# Altium project Smart_home_system.PrjPcb
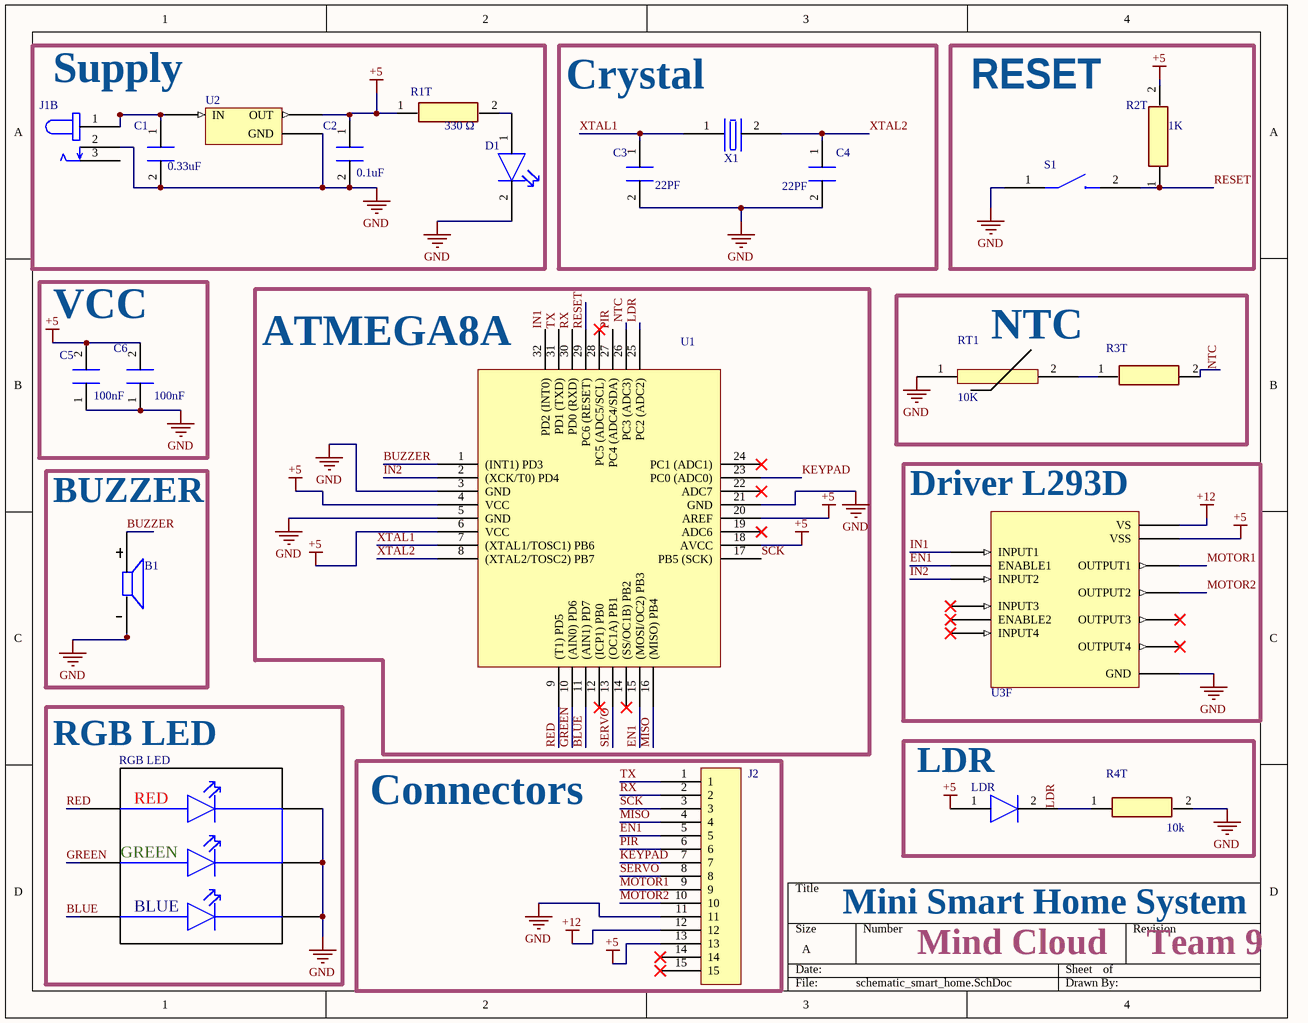
[diagram p0: schematic_smart_home.SchDoc]
Date: 9/2024; designer: Team 9; project: smart home system; Team: mind cloud
1 sheet, 22 parts. Net scope: global (net labels, ports and power ports of the same name join across sheets).
Board file: PCB_smart_home.PcbDoc

## Sheet schematic_smart_home.SchDoc
size A; SheetNumber: 1; SheetTotal: 1

### Parts
B1  CMT-1271-88-SMT-TR  [PCBComponent_1]  (value not drawn)
C1  0.33uF  [PCBComponent_1]
C2  0.1uF  [PCBComponent_1]
C3  22PF  [PCBComponent_1]
C4  22PF  [PCBComponent_1]
C5  100nF  [PCBComponent_1]
C6  100nF  [PCBComponent_1]
D1  KPT-1608ZGC  [PCBComponent_1]  (value not drawn)
J1  PJ-002AH-SMT-TR  [PCBComponent_1]  (value not drawn)  (part B of 2)
J2  connector;str header;single row;.1 cont centers;.095 tail;gold or gtx;36 contact  [Header]  (value not drawn)
LDR  RS1G  [PCBComponent_1]  (value not drawn)
R1  330 Ω  [RESC1005X04N]  (part T of 20)
R2  1K  [RESC1005X04N]  (part T of 20)
R3  resistor SMD  [RESC1005X04N]  (value not drawn)  (part T of 20)
R4  10k  [RESC1005X04N]  (part T of 20)
RGB_LED  ASMB-TTF2-0B20B  [PCBComponent_1]  (value not drawn)
RT1  10K  [RESC1005X04N]
S1  TS16-1212-85-BK-100-SMT-TR  [PCBComponent_1]  (value not drawn)
U1  ATMEGA8A-AU_C16190  [TQFP80P900X900X120-32N]  (value not drawn)
U2  MC78M05ACDTRKG  [PCBComponent_1]  (value not drawn)
U3  Driver L293D  [SOIC127P1030X265-20N]  (value not drawn)  (part F of 6)
X1  16 MHZ  [PCBComponent_1]  (value not drawn)

### Blocks framed on the sheet
Supply: C1 C2 D1 J1 R1 U2
Crystal: C3 C4 X1
RESET: R2 S1
VCC: C5 C6
ATMEGA8A: U1
NTC: R3 RT1
BUZZER: B1
Driver L293D: U3
RGB LED: RGB_LED
Connectors: J2
LDR: LDR R4

### Nets
+5: C2.1 C5.2 C6.2 J2.13 LDR.1 R1.1 R2.2 U1.4(VCC) U1.6(VCC) U1.18(AVCC) U1.20(AREF) U2.2(OUT) U3.7(VSS)
+12: J2.12 U3.6(INPUT4)
GND: B1.2 C1.2 C2.2 C3.2 C4.2 C5.1 C6.1 D1.2 J1.2 J2.11 R4.2 RGB_LED.2 RGB_LED.4 RGB_LED.6 RT1.1 S1.1 U1.3(GND) U1.5(GND) U1.21(GND) U2.3(GND) U3.13(GND)
BLUE: RGB_LED.5 U1.11((AIN1)_PD7)
BUZZER: B1.1 U1.1((INT1)_PD3)
EN1: J2.5 U1.15((MOSI/OC2)_PB3) U3.2(ENABLE1)
GREEN: RGB_LED.3 U1.10((AIN0)_PD6)
IN1: U1.32(PD2_(INT0)) U3.1(INPUT1)
IN2: U1.2((XCK/T0)_PD4) U3.3(INPUT2)
KEYPAD: J2.7 U1.23(PC0_(ADC0))
LDR: LDR.2 R4.1 U1.25(PC2_(ADC2))
MISO: J2.4 U1.16((MISO)_PB4)
MOTOR1: J2.9 U3.9(OUTPUT1)
MOTOR2: J2.10 U3.10(OUTPUT2)
NTC: R3.2 U1.26(PC3_(ADC3))
PIR: J2.6 U1.27(PC4_(ADC4/SDA))
RED: RGB_LED.1 U1.9((T1)_PD5)
RESET: R2.1 S1.2 U1.29(PC6_(RESET))
RX: J2.2 U1.30(PD0_(RXD))
SCK: J2.3 U1.17(PB5_(SCK))
SERVO: J2.8 U1.13((OC1A)_PB1)
TX: J2.1 U1.31(PD1_(TXD))
XTAL1: C3.1 U1.7((XTAL1/TOSC1)_PB6) X1.1
XTAL2: C4.1 U1.8((XTAL2/TOSC2)_PB7) X1.2
NetC1_1: C1.1 J1.1 U2.1(IN)
NetD1_1: D1.1 R1.2
NetR3_1: R3.1 RT1.2

Not connected (* = marked no-connect by the designer): J1 3; J2 14* 15*; U1 12((ICP1)_PB0)* 14((SS/OC1B)_PB2)* 19(ADC6)* 22(ADC7)* 24(PC1_(ADC1))* 28(PC5_(ADC5/SCL))*; U3 4(INPUT3)* 5(ENABLE2)* 11(OUTPUT3)* 12(OUTPUT4)*

### Notes on the sheet
- Mini Smart Home System
- Mind Cloud
- Team 9
- (in symbol RGB LED) RED; GREEN; BLUE

### Library data of the parts
B1 = buzzer: 88dB Passive (external drive) Electromagnetic Type 2.4kHz Buzzers ROHS; manufactor: CUI; ComponentLink1Description: snapeda link; ComponentLink1URL: https://www.snapeda.com/parts/CMT-1271-88-SMT-TR/CUI%20Devices/view-part/?ref=search&t=Buzzer%20smd; ComponentLink2Description: datasheet; ComponentLink2URL: https://www.snapeda.com/parts/CMT-1271-88-SMT-TR/CUI%20Devices/datasheet/; manufactor part number: CMT-1271-88-SMT-TR; supplier: LCSC; supplier part number: C3811771
C1-C6 = capacitor_1206 CODE: 100V 100nF C0G ±5% 1206 Multilayer Ceramic Capacitors MLCC - SMD/SMT ROHS; manufactor: Murata Electronics; manufactor part number: GRM31C5C2A104JA01L; ComponentLink1Description: snapeda link; ComponentLink1URL: https://www.snapeda.com/parts/GRM31C5C2A104JA01L/Murata/view-part/?ref=search&t=1206%20cap%20smd; ComponentLink2Description: Datasheet; ComponentLink2URL: https://www.snapeda.com/parts/GRM31C5C2A104JA01L/Murata/datasheet/; supplier: LCSC; supplier part number: C405303
D1 = LED: SMD LED Indication - Discrete ROHS; manufacturer: Kingbright; ComponentLink1Description: datasheet; ComponentLink1URL: https://www.snapeda.com/parts/KPT-1608ZGC/Kingbright/datasheet/; ComponentLink2Description: snapeda link; ComponentLink2URL: https://www.snapeda.com/parts/KPT-1608ZGC/Kingbright/view-part/?welcome=home&ref=search&t=LED+SMD; ComponentLink3Description: LCSC link; ComponentLink3URL: https://www.lcsc.com/product-detail/LED-Indication-Discrete_Kingbright-KPT-1608ZGC_C598364.html; manufacturer part number: KPT-1608ZGC; supplier: LCSC; supplier part number: C598364
J1 = DC connector: SMD DC Power Connectors ROHS; Manufacturer: CUI; ComponentLink1Description: snapeda link; ComponentLink1URL: https://www.snapeda.com/parts/PJ-002AH-SMT-TR/CUI%20Devices/view-part/?ref=search&t=DC%20connector%20SMD; ComponentLink2Description: datasheet; ComponentLink2URL: https://www.snapeda.com/parts/PJ-002AH-SMT-TR/CUI%20Devices/datasheet/; Manufacturer part number: PJ-002AH-SMT-TR; supplier: LCSC; supplier part number: C22434687; package: SMD
J2 = Single row; PCB headers: Manufacturer: FCI; Manufacturer Part No.: 68000-236HLF; Current Rating: 3Amps Continuous; Created By: R Kanjee; Date Created: 1 March 2015; RS Stock No.: 2509565626
LDR = LDR sensor: 1A Independent Type 1.3V@1A 400V SMA(DO-214AC) Diodes - General Purpose ROHS; manufactor: SMC(Sangdest Microelectronicstronic (Nanjing)); ComponentLink1Description: snapeda; ComponentLink1URL: https://www.snapeda.com/parts/RS1G/Taiwan%20Semiconductor/view-part/?ref=search&t=LDR%20sensor%20smd; ComponentLink2Description: datasheet; ComponentLink2URL: https://www.snapeda.com/parts/RS1G/Taiwan%20Semiconductor/datasheet/; manufactor part time: RS1G; supplier: LCSC; supplier part time: C260336
R1-R4 = Resistor: 500mW Thick Film Resistors 400V ±100ppm/℃ ±1% 100Ω 1210 Chip Resistor - Surface Mount ROHS; Manufacturer: PANASONIC; Manufacturer part Number: ERJ-U14F1000U; ComponentLink1Description: Datasheet; ComponentLink1URL: https://www.lcsc.com/datasheet/lcsc_datasheet_2201131530_PANASONIC-ERJ-U14F1000U_C1014086.pdf; Supplier: Lcsc; Supplier part number: C1014086
RGB_LED = RGB LED: PLCC-6 RGB LEDs ROHS; manufactor: Broadcom Limited; ComponentLink1Description: snapeda link; ComponentLink1URL: https://www.snapeda.com/parts/ASMB-TTF2-0B20B/Broadcom%20%2F%20Avago/view-part/?ref=search&t=RGB%20led%20smd; ComponentLink2Description: datasheet; ComponentLink2URL: https://www.snapeda.com/parts/ASMB-TTF2-0B20B/Avago%20Technologies/datasheet/; ComponentLink3Description: LCSC link; ComponentLink3URL: https://www.lcsc.com/product-detail/RGB-LEDs_Broadcom-Limited-ASMB-TTF2-0B20B_C6126294.html; manufactor part number: ASMB-TTF2-0B20B; supplier: LCSC; supplier part number: C6126294
RT1 = NTC temperature sensor: 10kΩ ±0.5% 3380K ±0.7% 0402 NTC Thermistors ROHS / Recommended For You; Manufacturer: Murata Electronics; Manufacturer part number: NCU15XH103D6SRC; ComponentLink1Description: datasheet; ComponentLink1URL: https://www.lcsc.com/datasheet/lcsc_datasheet_2401291008_Murata-Electronics-NCU15XH103D6SRC_C17294780.pdf; supplier: lcsc; supplier part number: C17294780
S1 = switch: 50mA Standing paste SPST - normally open 100gf 12V Tactile Switches ROHS; manufactor: CUI; ComponentLink1Description: snapeda; ComponentLink1URL: https://www.snapeda.com/parts/TS16-1212-85-BK-100-SMT-TR/CUI%20Devices/view-part/?ref=search&t=switch%20smd; ComponentLink2Description: datasheet; ComponentLink2URL: https://www.snapeda.com/parts/TS16-1212-85-BK-100-SMT-TR/CUI%20Devices/datasheet/; manufactor part time: TS16-1212-85-BK-100-SMT-TR; supplier: LCSC; supplier part number: C6338790
U1 = ATMEGA8A-AU: 8KB 1KB FLASH 23 2.7V~5.5V AVR 16MHz TQFP-32(7x7) Microcontrollers (MCU/MPU/SOC) ROHS; Manufacturer: Microchip Tech; ComponentLink1Description: Datasheet; ComponentLink1URL: https://www.lcsc.com/datasheet/lcsc_datasheet_1810161120_Microchip-Tech-ATMEGA8A-AU_C16190.pdf; Manufacturer part number: ATMEGA8A-AU; supplier: LCSC; Supplier part number: C16190
U2 = regulator: 500mA 80dB@(120Hz) Fixed 5V Positive electrode 35V TO-252-2(DPAK) Voltage Regulators - Linear, Low Drop Out (LDO) Regulators ROHS; Manufacturer: onsemi; ComponentLink1Description: snapeda link; ComponentLink1URL: https://www.snapeda.com/parts/MC78M05ACDTRKG/onsemi/view-part/?ref=search&t=regulator%205v%20smd; ComponentLink2Description: Datasheet; ComponentLink2URL: https://www.snapeda.com/parts/MC78M05ACDTRKG/onsemi/datasheet/; ComponentLink3Description: LCSC link; ComponentLink3URL: https://www.lcsc.com/product-detail/Voltage-Regulators-Linear-Low-Drop-Out-LDO-Regulators_onsemi-MC78M05ACDTRKG_C232660.html; Manufacturer part number: MC78M05ACDTRKG; supplier: LCSC; supplier part number: C232660
U3 = Driver L293D: SOIC-20-300mil Stepper Motor Driver ROHS; Manufacturer: STMicroelectronics; Manufacturer part number: L293DD013TR; ComponentLink1Description: datasheet; ComponentLink1URL: https://www.lcsc.com/datasheet/lcsc_datasheet_2304140030_STMicroelectronics-L293DD013TR_C21610.pdf; supplier: LCSC; supplier part number: C21610
X1 = crystal: 16MHz ±30ppm ±50ppm HC-49S-SMD Crystals ROHS; ComponentLink1Description: snapeda link; ComponentLink1URL: https://www.snapeda.com/parts/ECS-160-S-5P-TR/ECS%20International/view-part/?ref=search&t=16MHZ%20crystl; ComponentLink2Description: datasheet; ComponentLink2URL: https://www.lcsc.com/datasheet/lcsc_datasheet_2211020230_ECS-ECS-160-S-5P-TR_C2450888.pdf; ComponentLink3Description: LCSC link; ComponentLink3URL: https://www.lcsc.com/product-detail/Crystals_span-style-background-color-ff0-ECS-span-ECS-160-S-5P-TR_C2450888.html; manufactor: *; manufactor part number: *; supplier: *; supplier part number: *